# Altium schematic sheet OLED.SchDoc
size A; SheetNumber: 7; SheetTotal: 9
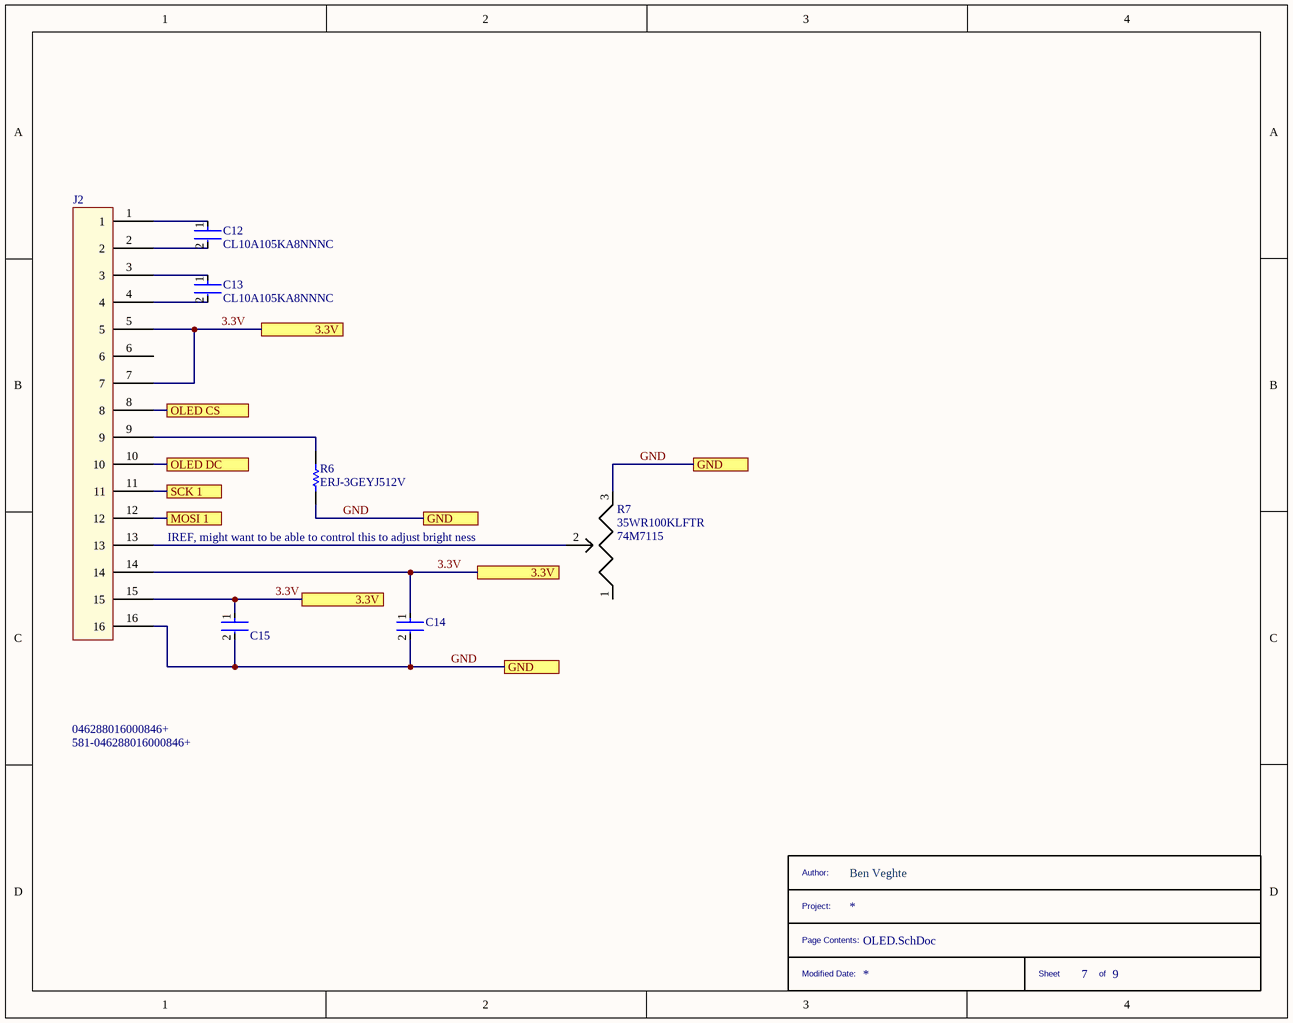
[diagram p0: OLED.SchDoc]

## Parts
*  __TITLE_BLOCK__  (value not drawn)  (graphical)
C12  CL10A105KA8NNNC  [FP-CL10-IPC_C]
C13  CL10A105KA8NNNC  [FP-CL10-IPC_C]
C14  CL10A106KP8NNND  [FP-CL10-IPC_B]  (value not drawn)
C15  CL10A106KP8NNND  [FP-CL10-IPC_B]  (value not drawn)
J2  046288016000846+  Supplier Part Number 1: 581-046288016000846+  [046288016000846+]
R6  ERJ-3GEYJ512V  [RESC1608X55X30LL15T15]
R7  35WR100KLFTR  Supplier Part Number 1: 74M7115  [35WR100KLFTR]

## Ports
3.3V, GND, MOSI 1, OLED CS, OLED DC, SCK 1

## Nets
3.3V: C14.1 C15.1 J2.5 J2.7 J2.14 J2.15 ; port 3.3V
GND: C14.2 C15.2 J2.16 R6.1 R7.3 ; port GND
MOSI 1: J2.12 ; port MOSI 1
OLED CS: J2.8 ; port OLED CS
OLED DC: J2.10 ; port OLED DC
SCK 1: J2.11 ; port SCK 1
NetC12_1: C12.1 J2.1
NetC12_2: C12.2 J2.2
NetC13_1: C13.1 J2.3
NetC13_2: C13.2 J2.4
NetJ2_9: J2.9 R6.2
NetJ2_13: J2.13 R7.2

Not connected (* = marked no-connect by the designer): J2 6; R7 1

## Notes on the sheet
- IREF, might want to be able to control this to adjust bright ness
- (in symbol __TITLE_BLOCK__) Author:; Ben Veghte; Project:; Page Contents:; Modified Date:; Sheet; of

## Library data of the parts
C12 C13 = CMP-13271-004127-1: Cap Ceramic 1uF 25V X5R ±10% Pad SMD 0603 +85°C T/R; Height: 0.8mm; Capacitance: 1uF; Depth: 0.8mm; Package Quantity: 1; Mount: Surface Mount; Contact Plating: Tin; Voltage Rating: 25V; Dielectric: X5R; Packaging: Tape and Reel; Material: Ceramic; Case Code (Metric): 1608; Length: 1.6mm; Voltage: 25V; Min Operating Temperature: -55°C; Width: 0.031inch; Tolerance: 10%; Case/Package: 0603; Radiation Hardening: No; Case Code (Imperial): 0603; Thickness: 0.035inch; Lead Free: Lead Free; Max Operating Temperature: 85°C; Voltage Rating (DC): 25V
C14 C15 = CMP-13271-003245-1: Cap Ceramic 10uF 10V X5R ±10% Pad SMD 0603 +85°C T/R; Packaging: Tape and Reel; Dielectric: X5R; Min Operating Temperature: -55°C; Lead Free: Lead Free; Height: 0.8mm; Package Quantity: 10000; Voltage Rating (DC): 10V; Mount: Surface Mount; Tolerance: 10%; Width: 0.031inch; Thickness: 0.035inch; Depth: 0.8mm; Max Operating Temperature: 85°C; Capacitance: 10uF; Case/Package: 0603; Length: 1.6mm; Voltage Rating: 10V; Radiation Hardening: No
J2 = 046288016000846+: Conn FFC/FPC Connector SKT 16 POS 0.5mm Solder RA SMD Automotive T/R; Manufacturer: Kyocera AVX; Current Rating: 400mA; Voltage Rating: 50V; Number of Positions: 16; Contact Location: Bottom; Gender: Male; Supplier 1: Mouser; Manufacturer Part Number: 046288016000846+; RoHS: Yes; Category: FFC / FPC; Stock 1: 2627; Pricing 1: 1=1.38000, 10=1.22000, 50=1.22000, 100=1.05000, 200=0.95100, 500=0.85600, 1000=0.76100, 2000=0.62700, 4000=0.61800, 10000=0.61800 (USD); Mount: Surface Mount; Contact Material: Copper Alloy; Contact Plating: Gold; Housing Material: Plastic; Min Operating Temperature: -40°C; Max Operating Temperature: 105°C; Packaging: Tape and Reel; Number of Rows: 1; Termination: Solder; Orientation: Right Angle; Package Quantity: 1; Number of Contacts: 16; Series: 6288; Pitch: 0.5mm; Radiation Hardening: No; Lead Free: Lead Free; ComponentLink1URL: https://datasheet.ciiva.com/10366/6288-10366323.pdf?src-supplier=Avnet; ComponentLink1Description: https://datasheet.ciiva.com/10366/6288-10366323.pdf?src-supplier=Avnet; ComponentLink2URL: https://datasheet.ciiva.com/18454/70107521-18454565.pdf?src-supplier=Allied+Electronics; ComponentLink2Description: https://datasheet.ciiva.com/18454/70107521-18454565.pdf?src-supplier=Allied+Electronics; ComponentLink3URL: https://datasheet.ciiva.com/671/6288-671255.pdf?src-supplier=Digi-Key; ComponentLink3Description: https://datasheet.ciiva.com/671/6288-671255.pdf?src-supplier=Digi-Key; ComponentLink4URL: https://datasheet.ciiva.com/16327/6288-16327495.pdf?src-supplier=Future+Electronics; ComponentLink4Description: https://datasheet.ciiva.com/16327/6288-16327495.pdf?src-supplier=Future+Electronics; ComponentLink5URL: https://datasheet.ciiva.com/671/6288-671256.pdf?src-supplier=Digi-Key; ComponentLink5Description: https://datasheet.ciiva.com/671/6288-671256.pdf?src-supplier=Digi-Key; ComponentLink6URL: https://datasheet.ciiva.com/671/6288-671257.pdf?src-supplier=Digi-Key; ComponentLink6Description: https://datasheet.ciiva.com/671/6288-671257.pdf?src-supplier=Digi-Key
R6 = CMP-2000-00803-1: Manufacturer: Panasonic; Part Number: ERJ-3GEYJ512V
R7 = 35WR100KLFTR: 35W Series 3 mm Open Frame 100 kOhm ±25 % Single-Turn Trimming Potentiometer; Manufacturer: TT BI; Resistance: 100kR; Power Rating: 100mW; Tolerance: 25%; Voltage Rating: 50V; Number of Turns: 1; Insulation Resistance: 100MR; Temperature Coefficient: 250ppm/°C; Supplier 1: Newark; Manufacturer Part Number: 35WR100KLFTR; RoHS: Yes; Category: Variable Resistors and Potentiometers; Stock 1: 19940; Pricing 1: 1=0.35800, 10=0.34100, 25=0.32400, 50=0.30100, 100=0.28500, 250=0.27700, 500=0.24900, 1000=0.23800 (USD); Min Operating Temperature: -40°C; Max Operating Temperature: 125°C; Package Quantity: 2000; Packaging: Tape and Reel; Resistor Type: Cermet; Termination: Solder; Voltage Rating (DC): 50V; Type: Potentiometer; Resistance Tolerance: 25%; Series: 37; Width: 1.55mm; REACH SVHC: No SVHC; Lead Free: Lead Free; RoHS Compliant: Yes; ComponentLink1URL: https://datasheet.ciiva.com/22715/4701-22715101.pdf?src-supplier=Element14; ComponentLink1Description: https://datasheet.ciiva.com/22715/4701-22715101.pdf?src-supplier=Element14; ComponentLink2URL: https://datasheet.ciiva.com/7634/4701-7634922.pdf?src-supplier=Element14; ComponentLink2Description: https://datasheet.ciiva.com/7634/4701-7634922.pdf?src-supplier=Element14